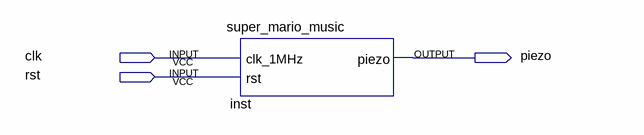
[diagram p0: schematic sheet]
// Quartus schematic music_test.bdf as structural Verilog: 1 symbols, 3 pins
module music_test (
  input  clk,
  input  rst,
  output piezo
);

  super_mario_music inst (.clk_1MHz(clk), .rst(rst), .piezo(piezo));
endmodule
